# Altium schematic sheet Voltage Regulation.SchDoc: Voltage Regulation
size A4; SheetNumber: 7; SheetTotal: 7
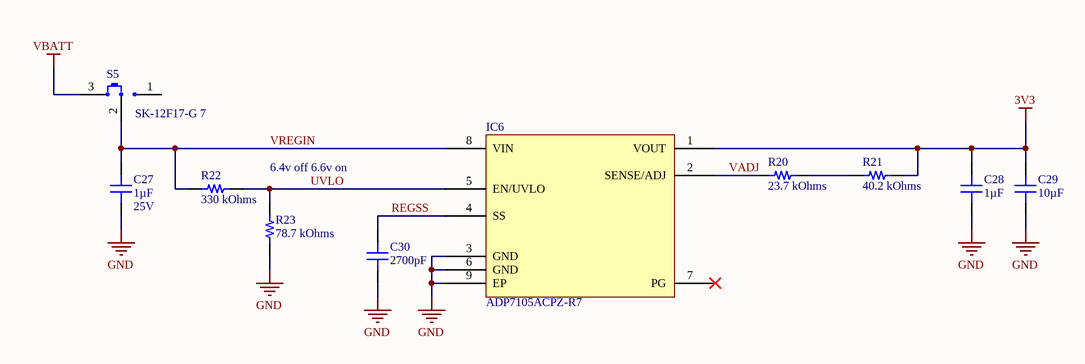
[diagram p0: Voltage Regulation.SchDoc]

## Parts
C27  Voltage - Rated: 25V  [CAP 0603_1608]  (hidden comment: 1µF)
C28  1µF  [CAP 0603_1608]
C29  10µF  [CAP 0805_2012]
C30  2700pF  [CAP 0603_1608]
IC6  ADP7105ACPZ-R7  [AD LFCSP-8 3x3MM CP-8-5]
R20  23.7 kOhms  [RES 0603_1608]
R21  40.2 kOhms  [RES 0603_1608]
R22  330 kOhms  [RES 0603_1608]
R23  78.7 kOhms  [RES 0603_1608]
S5  SK-12F17-G 7  [C&K SK-12F17-G 7]

## Nets
3V3: C28.2 C29.2 IC6.1(VOUT) R21.1
GND: C27.2 C28.1 C29.1 C30.1 IC6.3(GND) IC6.6(GND) IC6.9(EP) R23.1
VBATT: S5.3
REGSS: C30.2 IC6.4(SS)
UVLO: IC6.5(EN/UVLO) R22.2 R23.2
VADJ: IC6.2(SENSE/ADJ) R20.1
VREGIN: C27.1 IC6.8(VIN) R22.1 S5.2(COM)
NetR20_2: R20.2 R21.2

Not connected (* = marked no-connect by the designer): IC6 7(PG)*; S5 1

## Notes on the sheet
- 6.4v off 6.6v on
- Title
- Size:
- Date:
- A4
- Number:
- Time:
- Revision:
- Sheet
- of
- File:

## Library data of the parts
C27 = CL10A105KA8NNNC: CAP CER 1UF 25V X5R 0603; Manufacturer: Samsung Electro-Mechanics; Tolerance: ±10%; Part Number: CL10A105KA8NNNC; Value: 1µF; Applications: General Purpose; Capacitance: 1µF; ComponentLink1Description: Datasheet; ComponentLink1URL: http://www.samsungsem.com/kr/support/product-search/mlcc/CL10A105KA8NNNC.jsp; ComponentLink2Description: DigiKey Link; ComponentLink2URL: http://digikey.com/product-detail/en/samsung-electro-mechanics/CL10A105KA8NNNC/1276-1102-1-ND/3889188; Device Package: 0603 (1608 Metric); LastUpdated: 02/09/2020 01:03:30; Lifecycle Status: Active; Minimum Order: 1; Mounting Type: Surface Mount, MLCC; Operating Temperature: -55°C ~ 85°C; Package / Case: 0603 (1608 Metric); Packaging: TapeAndReel; PartId: 5508; Part Status: Active; Price: 0.01; Series: CL; Size / Dimension: 0.063" L x 0.031" W (1.60mm x 0.80mm); Supplier 1: DigiKey; Supplier Part Number 1: 1276-1102-1-ND; Temperature Coefficient: X5R; Thickness (Max): 0.035" (0.90mm)
C28 = LMK107B7105KA-T: CAP CER 1UF 10V X7R 0603; Manufacturer: Taiyo Yuden; Tolerance: ±10%; Part Number: LMK107B7105KA-T; Value: 1µF; Applications: General Purpose; Capacitance: 1µF; ComponentLink1Description: Datasheet; ComponentLink1URL: https://www.yuden.co.jp/productdata/catalog/mlcc01_e.pdf; ComponentLink2Description: DigiKey Link; ComponentLink2URL: http://digikey.com/product-detail/en/taiyo-yuden/LMK107B7105KA-T/587-1242-1-ND/931019; Device Package: 0603 (1608 Metric); LastUpdated: 02/09/2020 01:03:30; Lifecycle Status: Active; Minimum Order: 1; Mounting Type: Surface Mount, MLCC; Operating Temperature: -55°C ~ 125°C; Package / Case: 0603 (1608 Metric); Packaging: TapeAndReel; PartId: 5525; Part Status: Active; Price: 0.01; Series: M; Size / Dimension: 0.063" L x 0.031" W (1.60mm x 0.80mm); Supplier 1: DigiKey; Supplier Part Number 1: 587-1242-1-ND; Temperature Coefficient: X7R; Thickness (Max): 0.035" (0.90mm); Voltage - Rated: 10V
C29 = CL21A106KPCLQNC: CAP CER 10UF 10V X5R 0805; Manufacturer: Samsung Electro-Mechanics; Tolerance: ±10%; Part Number: CL21A106KPCLQNC; Value: 10µF; Applications: General Purpose; Capacitance: 10µF; ComponentLink1Description: Datasheet; ComponentLink1URL: http://www.samsungsem.com/kr/support/product-search/mlcc/CL21A106KPCLQNC.jsp; ComponentLink2Description: DigiKey Link; ComponentLink2URL: http://digikey.com/product-detail/en/samsung-electro-mechanics/CL21A106KPCLQNC/1276-2402-1-ND/3890488; Device Package: 0805 (2012 Metric); LastUpdated: 02/09/2020 01:04:19; Lifecycle Status: Active; Minimum Order: 1; Mounting Type: Surface Mount, MLCC; Operating Temperature: -55°C ~ 85°C; Package / Case: 0805 (2012 Metric); Packaging: TapeAndReel; PartId: 14319; Part Status: Active; Price: 0.03; Series: CL; Size / Dimension: 0.079" L x 0.049" W (2.00mm x 1.25mm); Supplier 1: DigiKey; Supplier Part Number 1: 1276-2402-1-ND; Temperature Coefficient: X5R; Thickness (Max): 0.037" (0.95mm); Voltage - Rated: 10V
C30 = CC0603KRX7R9BB272: CAP CER 2700PF 50V X7R 0603; Manufacturer: Yageo; Tolerance: ±10%; Part Number: CC0603KRX7R9BB272; Value: 2700pF; Applications: General Purpose; Capacitance: 2700pF; ComponentLink1Description: Datasheet; ComponentLink1URL: https://www.yageo.com/upload/media/product/productsearch/datasheet/mlcc/UPY-GPHC_X7R_6.3V-to-50V_18.pdf; ComponentLink2Description: DigiKey Link; ComponentLink2URL: http://digikey.com/product-detail/en/yageo/CC0603KRX7R9BB272/311-1809-1-ND/5195711; Device Package: 0603 (1608 Metric); LastUpdated: 02/09/2020 01:03:26; Lifecycle Status: Active; Minimum Order: 1; Mounting Type: Surface Mount, MLCC; Operating Temperature: -55°C ~ 125°C; Package / Case: 0603 (1608 Metric); Packaging: TapeAndReel; PartId: 7860; Part Status: Active; Price: 0.01; Series: CC; Size / Dimension: 0.063" L x 0.031" W (1.60mm x 0.80mm); Supplier 1: DigiKey; Supplier Part Number 1: 311-1809-1-ND; Temperature Coefficient: X7R; Thickness (Max): 0.035" (0.90mm); Voltage - Rated: 50V
IC6 = ADP7105ACPZ-R7: IC REG LIN POS ADJ 500MA 8LFCSP; Manufacturer: Analog Devices Inc.; Control Features: Enable, Power Good, Under Voltage Lockout; Current - Quiescent (Iq): 900µA; Current - Supply (Max): 1.6mA; Number of Regulators: 1; Output Configuration: Positive; Output Type: Adjustable; Protection Features: Over Current, Over Temperature, Reverse Polarity; PSRR: 80dB ~ 50dB (10kHz ~ 100kHz); Voltage Dropout (Max): 0.55V @ 500mA; Voltage - Input (Max): 20V; Voltage - Output (Max): 19V; Voltage - Output (Min/Fixed): 1.22V; Part Number: ADP7105ACPZ-R7; ComponentLink1Description: Datasheet; ComponentLink1URL: https://www.analog.com/media/en/technical-documentation/data-sheets/ADP7105.pdf; ComponentLink2Description: DigiKey Link; ComponentLink2URL: http://digikey.com/product-detail/en/analog-devices-inc/ADP7105ACPZ-R7/ADP7105ACPZ-R7CT-ND/4376403; Current - Output: 500mA; LastUpdated: 19/01/2022 13:38:13; Lifecycle Status: Active; Minimum Order: 1; Mounting Type: Surface Mount; Operating Temperature: -40°C ~ 125°C; Package / Case: 8-WFDFN Exposed Pad, CSP; Packaging: TapeAndReel; Part Status: Active; Price: 1.90; Series: -; Supplier 1: DigiKey; Supplier Part Number 1: ADP7105ACPZ-R7CT-ND; Supplier Device Package: 8-LFCSP-WD (3x3)
R20 = ERJ-3EKF2372V: RES SMD 23.7K OHM 1% 1/10W 0603; Manufacturer: Panasonic Electronic Components; Power (Watts): 0.1W, 1/10W; Temperature Coefficient: ±100ppm/°C; Part Number: ERJ-3EKF2372V; Value: 23.7 kOhms; ComponentLink1Description: Datasheet; ComponentLink1URL: https://industrial.panasonic.com/cdbs/www-data/pdf/RDA0000/AOA0000C304.pdf; ComponentLink2Description: DigiKey Link; ComponentLink2URL: http://digikey.com/product-detail/en/panasonic-electronic-components/ERJ-3EKF2372V/P23.7KHCT-ND/198263; Composition: Thick Film; Device Package: 0603 (1608 Metric); Features: Automotive AEC-Q200; Height - Seated (Max): 0.022" (0.55mm); LastUpdated: 02/09/2020 01:09:29; Lifecycle Status: Active; Minimum Order: 1; Number of Terminations: 2; Operating Temperature: -55°C ~ 155°C; Package / Case: 0603 (1608 Metric); Packaging: TapeAndReel; PartId: 26029; Part Status: Active; Price: 0.01; Ratings: AEC-Q200; Resistance: 23.7 kOhms; Series: ERJ; Size / Dimension: 0.063" L x 0.031" W (1.60mm x 0.80mm); Supplier 1: DigiKey; Supplier Part Number 1: P23.7KHCT-ND; Supplier Device Package: 0603; Tolerance: ±1%
R21 = ERJ-3EKF4022V: RES SMD 40.2K OHM 1% 1/10W 0603; Manufacturer: Panasonic Electronic Components; Power (Watts): 0.1W, 1/10W; Temperature Coefficient: ±100ppm/°C; Part Number: ERJ-3EKF4022V; Value: 40.2 kOhms; ComponentLink1Description: Datasheet; ComponentLink1URL: https://industrial.panasonic.com/cdbs/www-data/pdf/RDA0000/AOA0000C304.pdf; ComponentLink2Description: DigiKey Link; ComponentLink2URL: http://digikey.com/product-detail/en/panasonic-electronic-components/ERJ-3EKF4022V/P40.2KHCT-ND/198375; Composition: Thick Film; Device Package: 0603 (1608 Metric); Features: Automotive AEC-Q200; Height - Seated (Max): 0.022" (0.55mm); LastUpdated: 02/09/2020 01:09:43; Lifecycle Status: Active; Minimum Order: 1; Number of Terminations: 2; Operating Temperature: -55°C ~ 155°C; Package / Case: 0603 (1608 Metric); Packaging: TapeAndReel; PartId: 23106; Part Status: Active; Price: 0.01; Ratings: AEC-Q200; Resistance: 40.2 kOhms; Series: ERJ; Size / Dimension: 0.063" L x 0.031" W (1.60mm x 0.80mm); Supplier 1: DigiKey; Supplier Part Number 1: P40.2KHCT-ND; Supplier Device Package: 0603; Tolerance: ±1%
R22 = ERJ-PA3J334V: RES SMD 330K OHM 5% 1/4W 0603; Manufacturer: Panasonic Electronic Components; Power (Watts): 0.25W, 1/4W; Temperature Coefficient: ±200ppm/°C; Part Number: ERJ-PA3J334V; Value: 330 kOhms; ComponentLink1Description: Datasheet; ComponentLink1URL: https://industrial.panasonic.com/cdbs/www-data/pdf/RDO0000/AOA0000C331.pdf; ComponentLink2Description: DigiKey Link; ComponentLink2URL: http://digikey.com/product-detail/en/panasonic-electronic-components/ERJ-PA3J334V/P330KBZCT-ND/5036310; Composition: Thick Film; Device Package: 0603 (1608 Metric); Features: Automotive AEC-Q200, Pulse Withstanding; Height - Seated (Max): 0.022" (0.55mm); LastUpdated: 02/09/2020 01:10:16; Lifecycle Status: Active; Minimum Order: 1; Number of Terminations: 2; Operating Temperature: -55°C ~ 155°C; Package / Case: 0603 (1608 Metric); Packaging: TapeAndReel; PartId: 8919; Part Status: Active; Price: 0.01; Ratings: AEC-Q200; Resistance: 330 kOhms; Series: ERJ; Size / Dimension: 0.063" L x 0.031" W (1.60mm x 0.80mm); Supplier 1: DigiKey; Supplier Part Number 1: P330KBZCT-ND; Supplier Device Package: 0603; Tolerance: ±5%
R23 = ERJ-3EKF7872V: RES SMD 78.7K OHM 1% 1/10W 0603; Manufacturer: Panasonic Electronic Components; Power (Watts): 0.1W, 1/10W; Temperature Coefficient: ±100ppm/°C; Part Number: ERJ-3EKF7872V; Value: 78.7 kOhms; ComponentLink1Description: Datasheet; ComponentLink1URL: https://industrial.panasonic.com/cdbs/www-data/pdf/RDA0000/AOA0000C304.pdf; ComponentLink2Description: DigiKey Link; ComponentLink2URL: http://digikey.com/product-detail/en/panasonic-electronic-components/ERJ-3EKF7872V/P78.7KHCT-ND/198511; Composition: Thick Film; Device Package: 0603 (1608 Metric); Features: Automotive AEC-Q200; Height - Seated (Max): 0.022" (0.55mm); LastUpdated: 02/09/2020 01:09:29; Lifecycle Status: Active; Minimum Order: 1; Number of Terminations: 2; Operating Temperature: -55°C ~ 155°C; Package / Case: 0603 (1608 Metric); Packaging: TapeAndReel; PartId: 26003; Part Status: Active; Price: 0.01; Ratings: AEC-Q200; Resistance: 78.7 kOhms; Series: ERJ; Size / Dimension: 0.063" L x 0.031" W (1.60mm x 0.80mm); Supplier 1: DigiKey; Supplier Part Number 1: P78.7KHCT-ND; Supplier Device Package: 0603; Tolerance: ±1%
S5 = SK-12F17-G 7: SWITCH SLIDE SPDT 300MA 30V; Manufacturer: C&K; Actuator Length: 7.00mm; Actuator Type: Standard; Contact Timing: Not Specified; Current Rating (Amps): 300mA (DC); Switch Function: On-On; Part Number: SK-12F17-G 7; Circuit: SPDT; ComponentLink1Description: Datasheet; ComponentLink1URL: //media.digikey.com/pdf/Data%20Sheets/C&K/SK-12F17-G.pdf; ComponentLink2Description: DigiKey Link; ComponentLink2URL: http://digikey.com/product-detail/en/c-k/SK-12F17-G-7/CKN10393-ND/2747163; Contact Finish: Silver; Contact Material: Copper; LastUpdated: 22/01/2022 09:16:27; Lifecycle Status: Active; Minimum Order: 1; Mounting Type: Through Hole, Right Angle; Packaging: Bulk; PartId: 3; Part Status: Active; Price: 0.55; Series: SK, COMAX; Supplier 1: DigiKey; Supplier Part Number 1: CKN10393-ND; Termination Style: PC Pin; Voltage Rating - DC: 30V